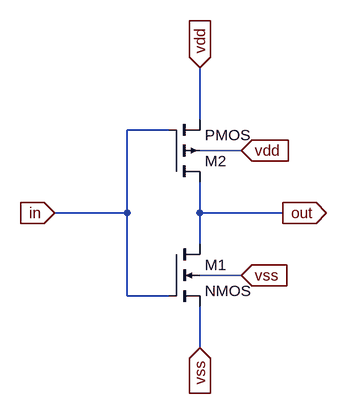
[diagram p0: schematic inv_lvt.asc]
inv_lvt.asc, the LTspice schematic file:
Version 4
SHEET 1 880 680
WIRE 272 -16 272 -96
WIRE 224 0 160 0
WIRE 336 32 272 32
WIRE 160 128 160 0
WIRE 160 128 48 128
WIRE 272 128 272 80
WIRE 400 128 272 128
WIRE 272 176 272 128
WIRE 336 224 272 224
WIRE 160 256 160 128
WIRE 224 256 160 256
WIRE 272 336 272 272
FLAG 272 -96 vdd
IOPIN 272 -96 In
FLAG 272 336 vss
IOPIN 272 336 In
FLAG 336 32 vdd
IOPIN 336 32 In
FLAG 336 224 vss
IOPIN 336 224 In
FLAG 400 128 out
IOPIN 400 128 Out
FLAG 48 128 in
IOPIN 48 128 In
SYMBOL nmos4 224 176 R0
SYMATTR InstName M1
SYMBOL pmos4 224 80 M180
SYMATTR InstName M2

The netlist it stands for:
* inv_lvt.asc
M1 out in vss vss NMOS
M2 out in vdd vdd PMOS
.model NMOS NMOS
.model PMOS PMOS
.lib standard.mos
.backanno
.end